# EAGLE design ADC board intermittent design 2 (EAGLE 9.4.1)
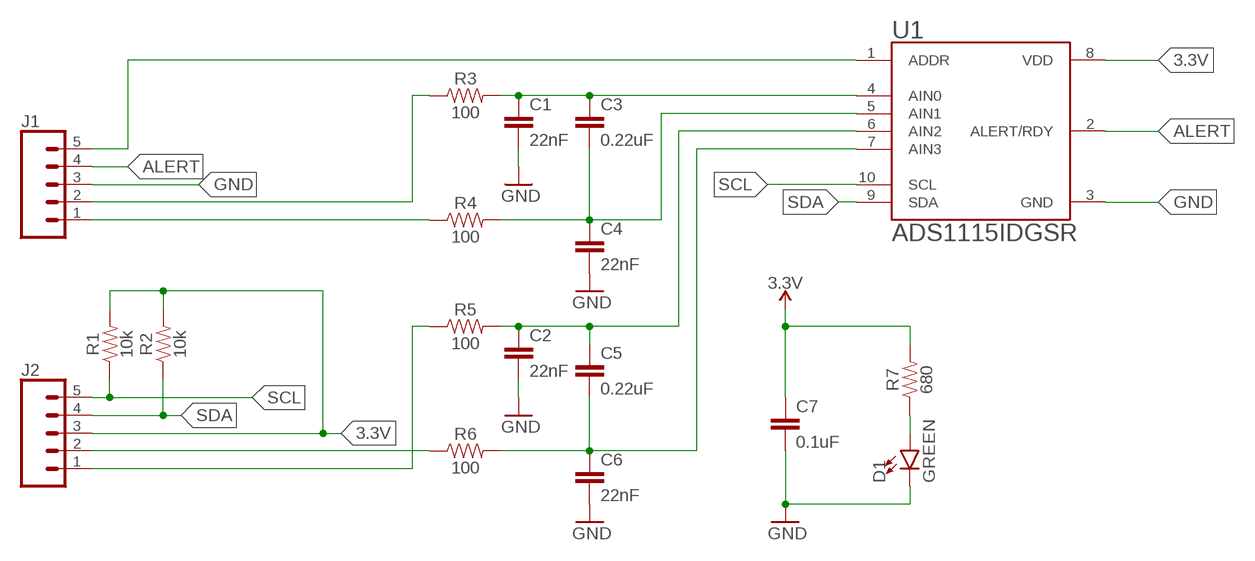
[diagram p0: schematic, sheet 1]

## Parts
C1  22nF  22NF/22,000PF-0603-50V-10%  [0603]
C2  22nF  22NF/22,000PF-0603-50V-10%  [0603]
C3  0.22uF  0.22UF-0603-25V-10%  [0603]
C4  22nF  22NF/22,000PF-0603-50V-10%  [0603]
C5  0.22uF  0.22UF-0603-25V-10%  [0603]
C6  22nF  22NF/22,000PF-0603-50V-10%  [0603]
C7  0.1uF  0.1UF-0402-16V-10%  [0402]
D1  GREEN  LED-GREEN0603  [LED-0603]
J1  CONN_05  [1X05]
J2  CONN_05  [1X05]
R1  10k  10KOHM-0603-1/10W-1%  [0603]
R2  10k  10KOHM-0603-1/10W-1%  [0603]
R3  100  100OHM-0603-1/4W-5%  [0603]
R4  100  100OHM-0603-1/4W-5%  [0603]
R5  100  100OHM-0603-1/4W-5%  [0603]
R6  100  100OHM-0603-1/4W-5%  [0603]
R7  680  680OHM-0603-1/10W-5%  [0603]
U1  ADS1115IDGSR  [SOP50P490X110-10N]

## Nets
3.3V: C7.1 J2.3 R1.2 R2.2 R7.2 U1.8(VDD)
ALERT: J1.4 U1.2(ALERT/RDY)
GND: C1.2 C2.2 C4.2 C6.2 C7.2 D1.C J1.3 U1.3(GND)
N$1: C1.1 C3.1 R3.2 U1.4(AIN0)
N$2: C3.2 C4.1 R4.2 U1.5(AIN1)
N$3: C2.1 C5.1 R5.2 U1.6(AIN2)
N$4: C5.2 C6.1 R6.2 U1.7(AIN3)
N$5: J1.2 R3.1
N$6: J1.1 R4.1
N$7: J2.1 R5.1
N$8: J2.2 R6.1
N$9: J1.5 U1.1(ADDR)
N$10: D1.A R7.1
SCL: J2.5 R1.1 U1.10(SCL)
SDA: J2.4 R2.1 U1.9(SDA)

## Library data of the parts
C1 C2 C4 C6 = SparkFun-Capacitors:22NF/22,000PF: 0.022uF/22nF/22,000pF ceramic capacitors A capacitor is a passive two-terminal electrical component used to store electrical energy temporarily in an electric field.; PROD_ID: CAP-07885
C3 C5 = SparkFun-Capacitors:0.22UF: 0.22µF ceramic capacitors A capacitor is a passive two-terminal electrical component used to store electrical energy temporarily in an electric field.; PROD_ID: CAP-07822
C7 = SparkFun-Capacitors:0.1UF: 0.1µF ceramic capacitors A capacitor is a passive two-terminal electrical component used to store electrical energy temporarily in an electric field.; PROD_ID: CAP-12416
D1 = SparkFun-LED:LED-GREEN: Green SMD LED Used in manufacturing of various products at SparkFun Packages: 0603 - SMD 0603 package [Product Link] <http://www.futureelectronics.com/en/technologies/semiconductors/optoelectronics/leds/Pages/9894312-LTST-C190GKT.aspx?CrossPart=HSMG-C190&IM=0> LilyPad 1206 - SMD1206 LilyPad package [Product Link] <http://www.futureelectronics.com/en/Technologies/Product.aspx?ProductID=IN150NGHARVATEKCORPORATION2049943&IM=0> 1206 - SMD1206 package [Product Link] <http://www.futureelectronics.com/en/technologies/semiconductors/optoelectronics/leds/Pages/8315665-LTST-C150KGKT.aspx?IM=0> 1206 Bottom Mount -SMD 1206 Bottom Mount [Product Link] <http://www.digikey.com/product-detail/en/lite-on-inc/LTST-C230KGKT/160-1456-1-ND/386854> SparkFun Products: Pro Mini 328 -5V <https://www.sparkfun.com/products/821> RedBoard <https://www.sparkfun.com/products/12757> MP3 Trigger <https://www.sparkfun.com/products/13720> Makey Makey <https://www.sparkfun.com/products/11076>; PROD_ID: DIO-00821
J1 J2 = SparkFun-Connectors:CONN_05: Multi connection point. Often used as Generic Header-pin footprint for 0.1 inch spaced/style header connections On any of the 0.1 inch spaced packages, you can populate with these: Break Away Headers - Straight <https://www.sparkfun.com/products/116> (PRT-00116) Break Away Male Headers - Right Angle <https://www.sparkfun.com/products/553> (PRT-00553) Female Headers <https://www.sparkfun.com/products/115> (PRT-00115) Break Away Headers - Machine Pin <https://www.sparkfun.com/products/117> (PRT-00117) Break Away Female Headers - Swiss Machine Pin <https://www.sparkfun.com/products/743> (PRT-00743) For SCREWTERMINALS and SPRING TERMINALS visit here: Screw Terimnals on SparkFun.com <https://www.sparkfun.com/search/results?term=Screw+Terminals> (5mm/3.5mm/2.54mm spacing) This device is also useful as a general connection point to wire up your design to another part of your project. Our various solder wires solder well into these plated through hole pads. Hook-Up Wire - Assortment (Stranded, 22 AWG) <https://www.sparkfun.com/products/11375> (PRT-11375) Hook-Up Wire - Assortment (Solid Core, 22 AWG) <https://www.sparkfun.com/products/11367> (PRT-11367) View the entire wire category on our website here <https://www.sparkfun.com/categories/141> Special notes: Molex polarized connector foot print use with SKU : PRT-08231 with associated crimp pins and housings. 1MM SMD Version SKU: PRT-10208
R1 R2 = SparkFun-Resistors:10KOHM: 10kΩ resistor A resistor is a passive two-terminal electrical component that implements electrical resistance as a circuit element. Resistors act to reduce current flow, and, at the same time, act to lower voltage levels within circuits. - Wikipedia; PROD_ID: RES-00824
R3-R6 = SparkFun-Resistors:100OHM: 100Ω resistor A resistor is a passive two-terminal electrical component that implements electrical resistance as a circuit element. Resistors act to reduce current flow, and, at the same time, act to lower voltage levels within circuits. - Wikipedia; PROD_ID: RES-12438
R7 = SparkFun-Resistors:680OHM: 680Ω resistor A resistor is a passive two-terminal electrical component that implements electrical resistance as a circuit element. Resistors act to reduce current flow, and, at the same time, act to lower voltage levels within circuits. - Wikipedia; PROD_ID: RES-09333
U1 = ADS1115IDGSR:ADS1115IDGSR: 16-Bit ADC with Integrated MUX, PGA, Comparator, Oscillator, and Reference 10-VSSOP -40 to 125; DESCRIPTION: 16-Bit ADC with Integrated MUX, PGA, Comparator, Oscillator, and Reference 10-VSSOP -40 to 125; DIGI-KEY_PART_NUMBER: 296-38849-1-ND; DIGI-KEY_PURCHASE_URL: https://www.digikey.com/product-detail/en/texas-instruments/ADS1115IDGSR/296-38849-1-ND/5142969?utm_source=snapeda&utm_medium=aggregator&utm_campaign=symbol; MF: Texas Instruments; MP: ADS1115IDGSR; PACKAGE: MSOP-10 Texas Instruments

## Board
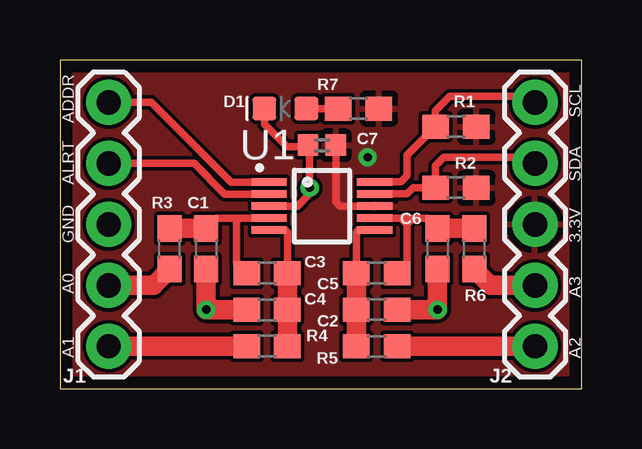
[diagram p1: board, top side]
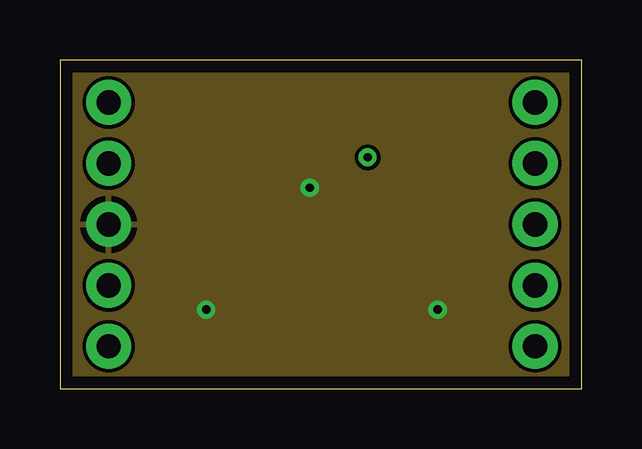
[diagram p2: board, inner layer Route2]
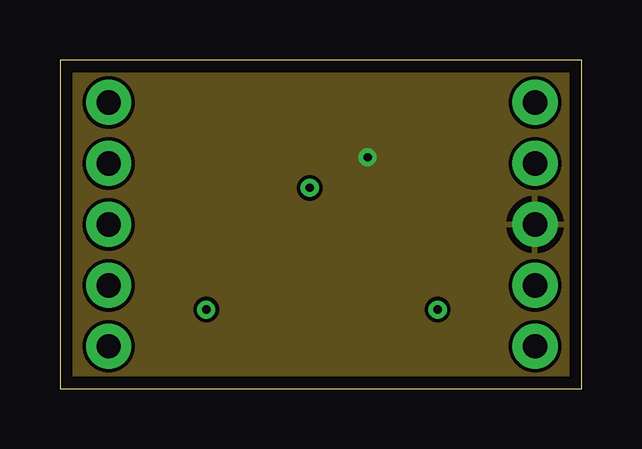
[diagram p3: board, inner layer Route15]
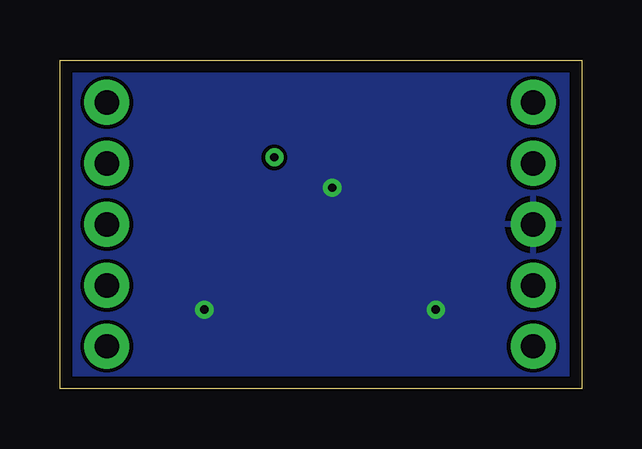
[diagram p4: board, bottom side, seen from below]

Size 21.77 x 13.71 mm. Coordinates in mm from the lower left corner, seen from the top.
Outline: 0,0 21.77,0 21.77,13.71 0,13.71 0,0
Copper layers (1+2*15+16): Top 0.0178mm / dielectric 12mil / Route2 0.0356mm / dielectric 28mil / Route15 0.0356mm / dielectric 12mil / Bottom 0.0178mm
Design rules "SSC-EAGLE-4Lyr_v1.0.0.3": minimum track width 6mil, minimum drill 8mil, track to track 6mil, track to pad 6mil, pad to pad 6mil, via to via 6mil, smd to smd 6mil, copper to edge 20mil, drill to drill 16mil, minimum pad ring 8mil, minimum via ring 8mil, stop-mask expansion 3mil, vias tented up to drill 0mil, thermal gap 10mil

### Footprints (pad centres in the part's own frame; a part is rotated, then mirrored left to right if it is on the bottom)
0603 = smd 1.1 x 1: 1 -0.85,0; 2 0.85,0
0402 = smd 0.85 x 0.9: 1 -0.58,0; 2 0.58,0
LED-0603 = smd 1 x 1: A -0.877,0; C 0.877,0
1X05 = drill 1.016 pad 1.88: 1 0,0; 2 2.54,0; 3 5.08,0; 4 7.62,0; 5 10.16,0
SOP50P490X110-10N = smd 1.45 x 0.3: 1 -2.2,1 | smd 1.47 x 0.3: 2 -2.2,0.5; 3 -2.2,0; 4 -2.2,-0.5; 5 -2.2,-1; 6 2.2,-1; 7 2.2,-0.5; 8 2.2,0; 9 2.2,0.5; 10 2.2,1

### Placement (x,y rotation side)
C1  6.1,5.84 270 top
C2  13.21,3.3 0 top
C3  8.64,4.83 0 top
C4  8.64,3.3 180 top
C5  13.21,4.83 0 top
C6  15.75,5.84 270 top
C7  10.92,10.16 180 top
D1  9.4,11.68 180 top
J1  2.03,1.78 90 top
J2  19.81,1.78 90 top
R1  16.51,10.92 0 top
R2  16.51,8.38 0 top
R3  4.57,5.84 90 top
R4  8.64,1.78 0 top
R5  13.21,1.78 180 top
R6  17.27,5.84 90 top
R7  12.45,11.68 0 top
U1  10.92,7.62 0 top

### Tracks (layer width: path | path; a pad name or v marks a point on that pad's centre or on a via)
3.3V  (via drill 0.35)
  Top 0.305: U1.8 11.68,7.62 11.5,7.8 C7.1
  other vias: 12.83,9.65
  pour Top: 0,13.72 21.84,13.72 21.84,0 0,0
  pour Route15: 0,13.72 21.84,13.72 21.84,0 0,0
ALERT
  Top 0.305: U1.2 6.87,8.12 5.59,9.4 J1.4
GND  (via drill 0.35)
  Top 0.305: U1.3 9.91,7.62 10.41,8.13 v10.41,8.38 10.41,10.09 | C7.2 10.41,10.09 | D1.C 8.52,11.04 9.47,10.09 10.41,10.09
  Top 0.813: C4.2 v6.1,3.3 C1.2 | C2.2 v15.75,3.3 C6.2
  pour Route2: 0,13.72 21.84,13.72 21.84,0 0,0
  pour Bottom: 0,13.72 21.84,13.72 21.84,0 0,0
N$1
  Top 0.305: U1.4 7.37,7.12 | 7.37,7.12 6.52,7.12 C1.1 | C3.1 7.37,5.25 7.37,7.12
  Top 0.813: C1.1 R3.2
N$2
  Top 0.305: U1.5 9.4,6.62 9.49,6.53 C3.2
  Top 0.813: C3.2 C4.1 R4.2
N$3
  Top 0.305: U1.6 12.45,6.62 12.36,6.53 C5.1
  Top 0.813: C5.1 C2.1 R5.2
N$4
  Top 0.305: U1.7 14.22,7.12 | 14.22,7.12 14.48,7.12 | 14.48,7.12 14.74,7.12 | 14.74,7.12 15.32,7.12 C6.1 | 14.48,7.12 14.48,6.86 | 14.48,6.86 14.48,5.25 C5.2 | 14.74,7.12 14.48,6.86 | 14.22,7.12 14.22,7.11 14.48,6.86
  Top 0.813: C6.1 R6.2
N$5
  Top 0.813: R3.1 3.9,4.32 J1.2
N$6
  Top 0.813: R4.1 J1.1
N$7
  Top 0.813: R5.1 J2.1
N$8
  Top 0.813: J2.2 17.95,4.32 R6.1
N$9
  Top 0.305: U1.1 7.13,8.62 5.33,10.41 3.81,11.94 J1.5
N$10
  Top 0.305: R7.1 D1.A
SCL
  Top 0.305: U1.10 13.14,8.64 14.22,8.64 14.48,8.89 14.48,9.74 R1.1 15.66,11.6 16.26,12.19 19.56,12.19 J2.5
SDA
  Top 0.305: U1.9 14.48,8.13 14.73,8.38 R2.1 15.66,9.31 16,9.65 19.56,9.65 J2.4

### Text on the board
tNames: ADDR | SCL | ALRT | SDA | GND | 3.3V | A0 | A3 | A1 | A2